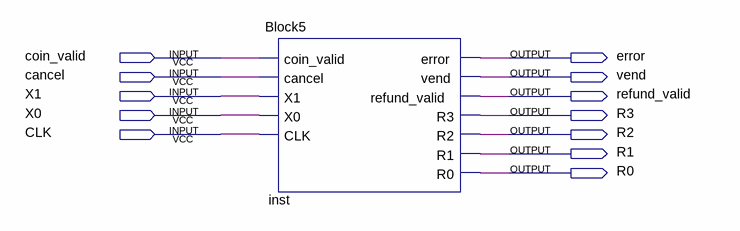
[diagram p0: schematic sheet]
// Quartus schematic Block6.bdf as structural Verilog: 1 symbols, 12 pins
module Block6 (
  input  coin_valid,
  input  cancel,
  input  X1,
  input  X0,
  input  CLK,
  output error,
  output vend,
  output refund_valid,
  output R3,
  output R2,
  output R1,
  output R0
);

  Block5 inst (
    .coin_valid(coin_valid), .cancel(cancel), .X1(X1), .X0(X0), .CLK(CLK), .error(error), .vend(vend),
    .refund_valid(refund_valid), .R3(R3), .R2(R2), .R1(R1), .R0(R0));
endmodule
